# Altium schematic sheet obc-v2_EXP-CAN-RS422.SchDoc
size 420 x 297 mm; SheetNumber: 14; SheetTotal: 23
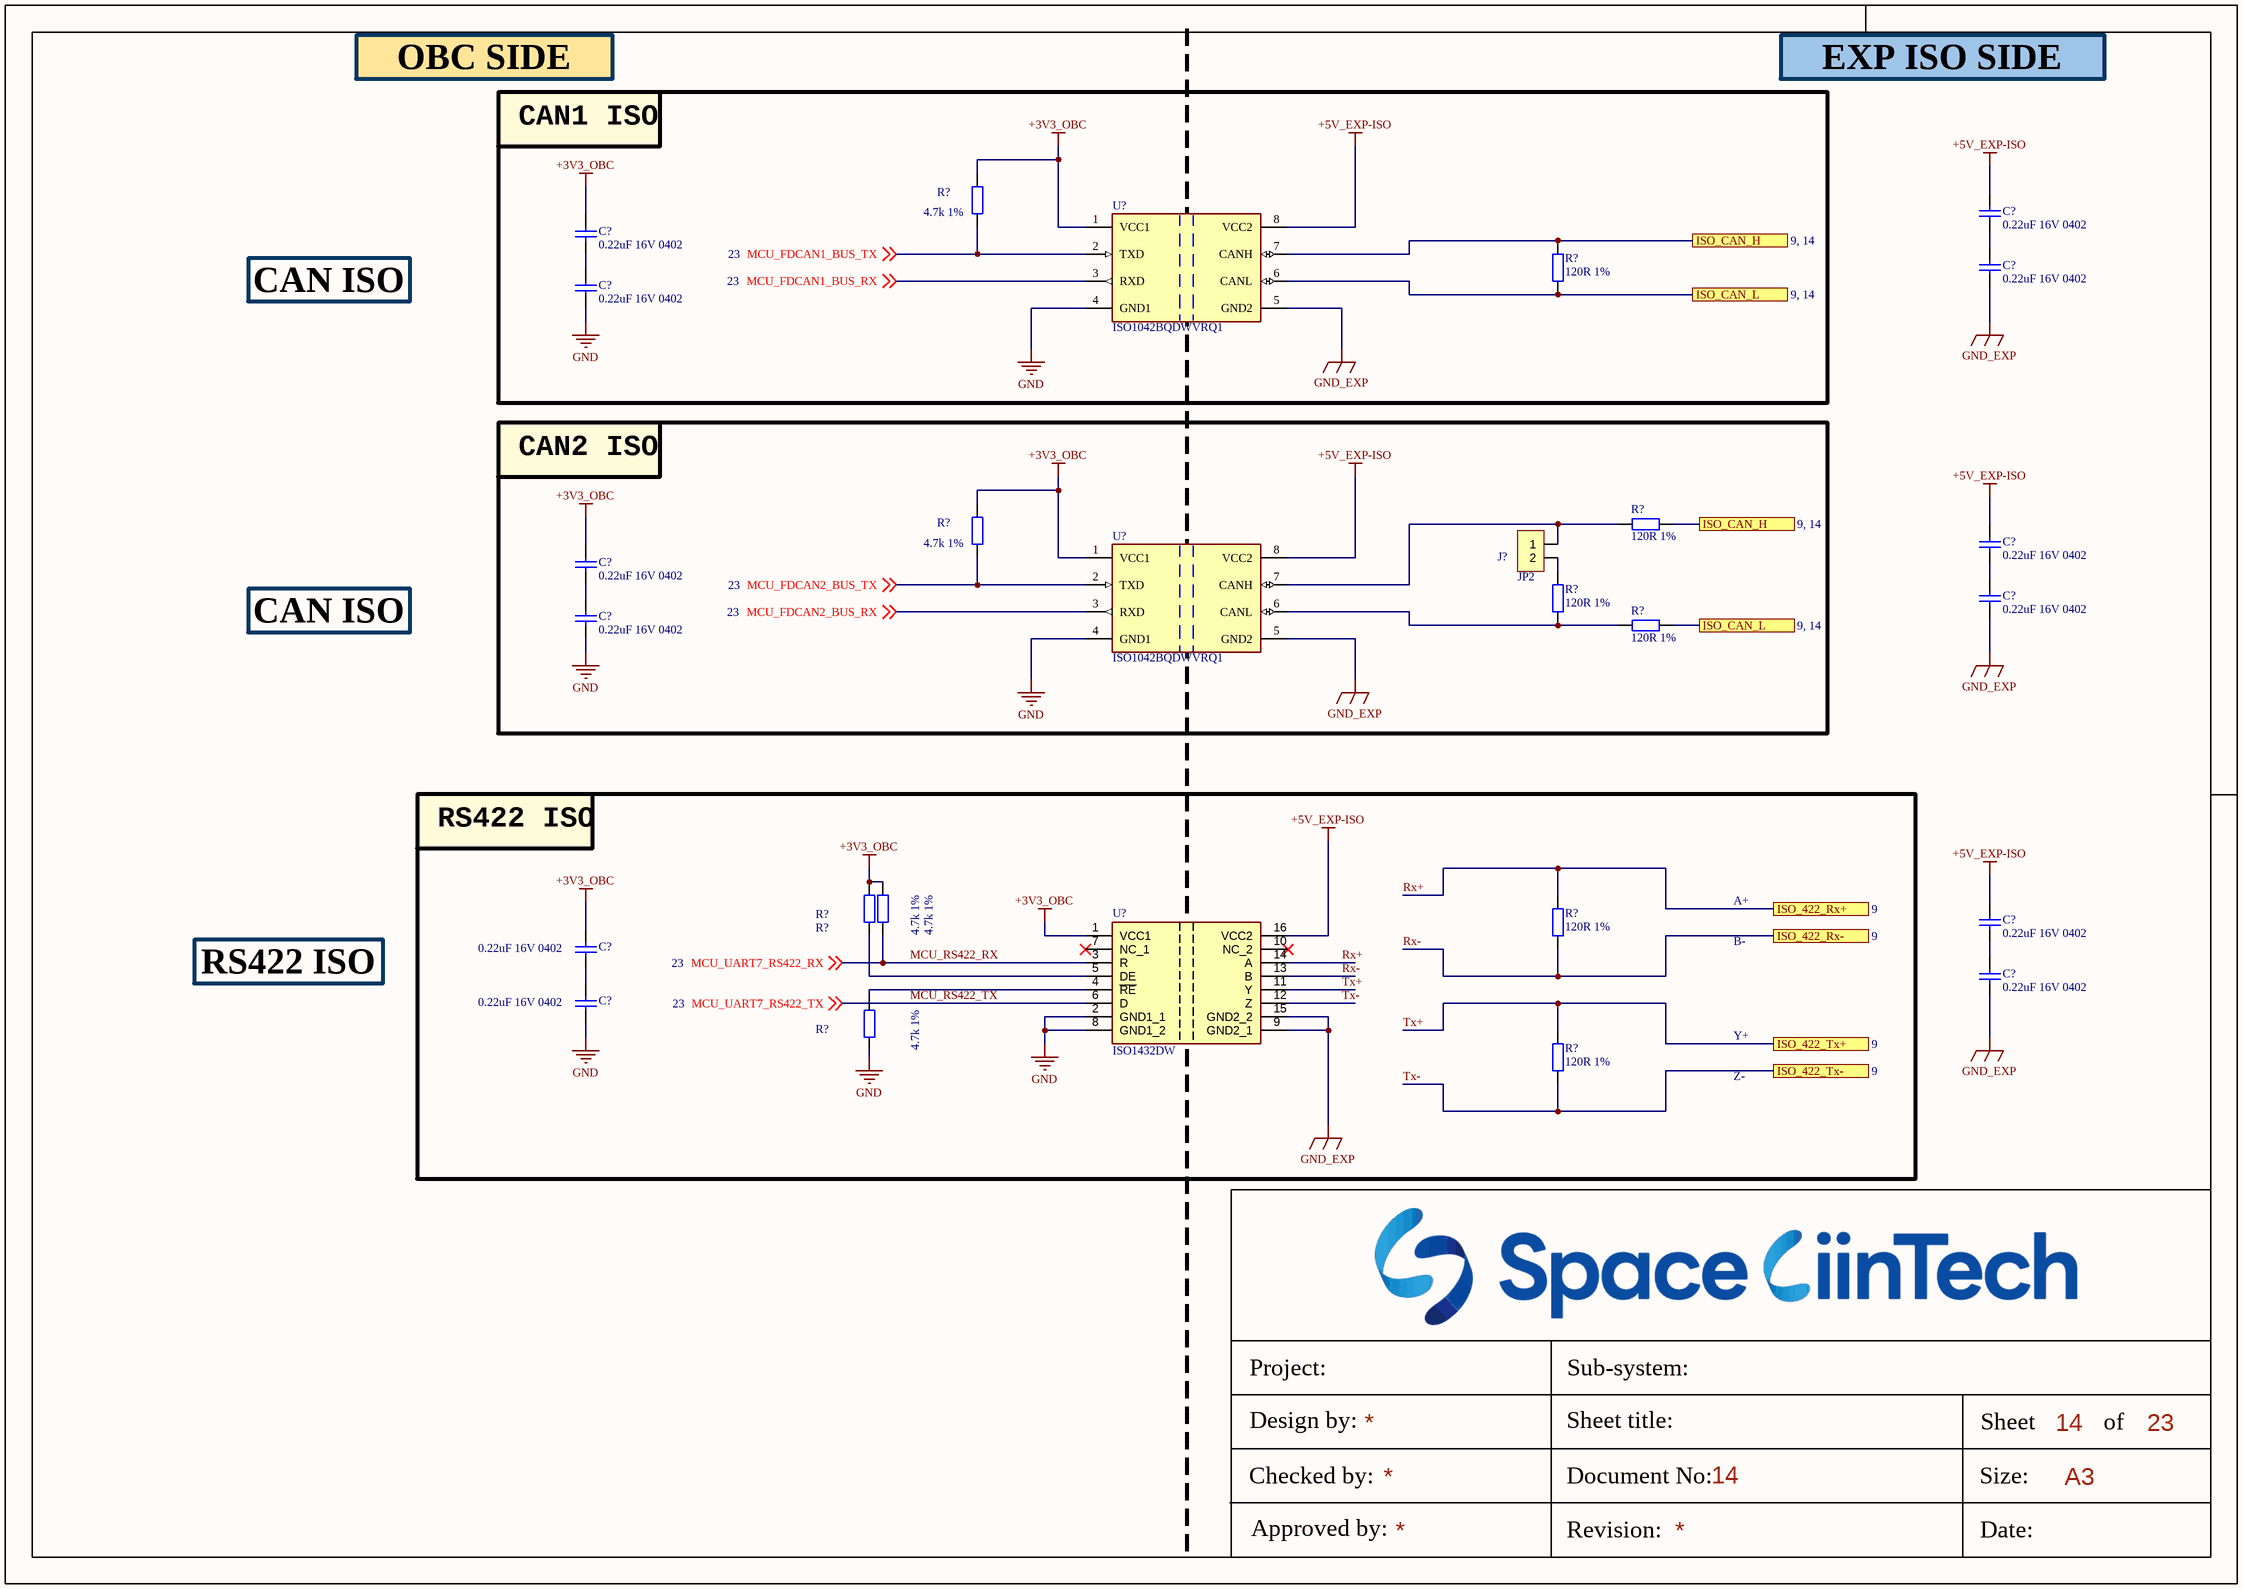
[diagram p0: obc-v2_EXP-CAN-RS422.SchDoc]

## Parts
(Parts that share a designator on the sheet are numbered #1, #2 ... from top to bottom, then left to right.)
C?#1  0.22uF 16V 0402  [tu 0402]
C?#2  0.22uF 16V 0402  [tu 0402]
C?#3  0.22uF 16V 0402  [tu 0402]
C?#4  0.22uF 16V 0402  [tu 0402]
C?#5  0.22uF 16V 0402  [tu 0402]
C?#6  0.22uF 16V 0402  [tu 0402]
C?#7  0.22uF 16V 0402  [tu 0402]
C?#8  0.22uF 16V 0402  [tu 0402]
C?#9  0.22uF 16V 0402  [tu 0402]
C?#10  0.22uF 16V 0402  [tu 0402]
C?#11  0.22uF 16V 0402  [tu 0402]
C?#12  0.22uF 16V 0402  [tu 0402]
J?  JP2  [JP2-D1T]
R?#1  4.7k 1%  [tro smd 0603]
R?#2  120R 1%  [tro smd 0603]
R?#3  120R 1%  [tro smd 0603]
R?#4  4.7k 1%  [tro smd 0603]
R?#5  120R 1%  [tro smd 0603]
R?#6  120R 1%  [tro smd 0603]
R?#7  4.7k 1%  [tro smd 0603]
R?#8  4.7k 1%  [tro smd 0603]
R?#9  120R 1%  [tro smd 0603]
R?#10  4.7k 1%  [tro smd 0603]
R?#11  120R 1%  [tro smd 0603]
U?#1  ISO1042BQDWVRQ1  [FP-DWV0008A-IPC_B]
U?#2  ISO1042BQDWVRQ1  [FP-DWV0008A-IPC_B]
U?#3  ISO1432DW  [SOIC127P1030X265-16N]

## Blocks framed on the sheet
CAN1 ISO: C?#2 C?#4 R?#1 R?#2 U?#1
CAN2 ISO: C?#6 C?#8 J? R?#3-R?#6 U?#2
RS422 ISO: C?#10 C?#12 R?#7-R?#11 U?#3

## Ports
ISO_422_Rx+ (see 9), ISO_422_Rx- (see 9), ISO_422_Tx+ (see 9), ISO_422_Tx- (see 9), ISO_CAN_H (see 9, 14), ISO_CAN_L (see 9, 14)

## Nets
+3V3_OBC: C?#2.1 C?#6.1 C?#10.1 R?#1.2 R?#4.2 R?#7.2 R?#8.2 U?#1.1(VCC1) U?#2.1(VCC1) U?#3.1(VCC1)
+5V_EXP-ISO: C?#1.1 C?#5.1 C?#9.2 U?#1.8(VCC2) U?#2.8(VCC2) U?#3.16(VCC2)
GND: C?#4.2 C?#8.2 C?#12.2 R?#10.1 U?#1.4(GND1) U?#2.4(GND1) U?#3.2(GND1_1) U?#3.8(GND1_2)
GND_EXP: C?#3.2 C?#7.2 C?#11.1 U?#1.5(GND2) U?#2.5(GND2) U?#3.9(GND2_1) U?#3.15(GND2_2)
ISO_CAN_H: R?#2.2 R?#3.1 U?#1.7(CANH) ; port ISO_CAN_H
ISO_CAN_L: R?#2.1 R?#6.1 U?#1.6(CANL) ; port ISO_CAN_L
MCU_FDCAN1_BUS_RX: U?#1.3(RXD) ; off-sheet MCU_FDCAN1_BUS_RX
MCU_FDCAN1_BUS_TX: R?#1.1 U?#1.2(TXD) ; off-sheet MCU_FDCAN1_BUS_TX
MCU_FDCAN2_BUS_RX: U?#2.3(RXD) ; off-sheet MCU_FDCAN2_BUS_RX
MCU_FDCAN2_BUS_TX: R?#4.1 U?#2.2(TXD) ; off-sheet MCU_FDCAN2_BUS_TX
MCU_RS422_RX: R?#8.1 U?#3.3(R) ; off-sheet MCU_UART7_RS422_RX  [also labelled MCU_UART7_RS422_RX]
MCU_RS422_TX: U?#3.6(D) ; off-sheet MCU_UART7_RS422_TX  [also labelled MCU_UART7_RS422_TX]
Rx+: R?#9.2 U?#3.14(A) ; port ISO_422_Rx+
Rx-: R?#9.1 U?#3.13(B) ; port ISO_422_Rx-
Tx+: R?#11.2 U?#3.11(Y) ; port ISO_422_Tx+
Tx-: R?#11.1 U?#3.12(Z) ; port ISO_422_Tx-
NetC?#1_2: C?#1.2 C?#3.1
NetC?#2_2: C?#2.2 C?#4.1
NetC?#5_2: C?#5.2 C?#7.1
NetC?#6_2: C?#6.2 C?#8.1
NetC?#9_1: C?#9.1 C?#11.2
NetC?#10_2: C?#10.2 C?#12.1
NetJ?_1: J?.1 R?#3.2 U?#2.7(CANH)
NetJ?_2: J?.2 R?#5.2
NetR?#5_1: R?#5.1 R?#6.2 U?#2.6(CANL)
NetR?#7_1: R?#7.1 U?#3.5(DE)
NetR?#10_2: R?#10.2 U?#3.4(~{RE})

Not connected (* = marked no-connect by the designer): U?#3 7(NC_1)* 10(NC_2)*

## Notes on the sheet
- OBC SIDE
- EXP ISO SIDE
- CAN ISO
- A+
- RS422 ISO
- B-
- Y+
- Z-
- Project:
- Sub-system:
- Design by:
- Sheet title:
- Sheet
- A3
- of
- Checked by:
- Approved by:
- Revision:
- Document No:
- Size:
- Date:

## Library data of the parts
C?#1-C?#12 = Tu 0402 33nF 10V: 0.22 µF ±10% 16V Ceramic Capacitor X7R 0402 (1005 Metric): GCM155R71C224KE02D; Chung_Loai: Dán; Don_Vi: Con; So_Chan: 2; Ten_Linh_Kien: Tụ 0402 33nF X7R 10V GRM155R71A333KA01D; Ma_Hang: MH007853; Kieu_Chan: *
J? = JP2: WR-PHD 2.54 mm Angled Socket Header; Manufacturer: W¨¹rth Elektronik eiSos GmbH; partNo: 613002143121; ComponentLink1 Description: Manufacturer; ComponentLink2 Description: Datasheet; NoPins: 02; Created Date: 29 March 2013; ComponentLink1URL: http://www.we-online.com; ComponentLink2URL: http://katalog.we-online.de/em/datasheet/6130xx143121.pdf; Created by: Karrer Zheng
R?#1 R?#4 R?#7 R?#8 R?#10 = Tro 0603 1% 10k: RES 4.7K OHM 1% 1/10W 0603, P/N: ERJ-U03F4701V; Chung_Loai: Dán; Don_Vi: Con; So_Chan: 2; Ten_Linh_Kien: Trở 0603 1% 10k; Ma_Hang: MH006333; Kieu_Chan: *
R?#2 R?#3 R?#5 R?#6 R?#9 R?#11 = Tro 0603 1% 10k: RES SMD 120 OHM 1% 1/4W 0603, P/N: RCS0603120RFKEA; Chung_Loai: Dán; Don_Vi: Con; So_Chan: 2; Ten_Linh_Kien: Trở 0603 1% 10k; Ma_Hang: MH006333; Kieu_Chan: *
U?#1 U?#2 = CMP-04872-000086-1: TRANSCEIVER; RoHS Compliant: Yes
U?#3 = ISO1432DWR: RS-422/RS-485 Interface IC 5-kVrms isolated RS-485/RS-422 transceiver with robust EMC 16-SOIC -40 to 125; Manufacturer_Name: Texas Instruments; Manufacturer_Part_Number: ISO1430DW; Geometry.Height: 2.65mm; Mouser Part Number: 595-ISO1430DW; Mouser Price/Stock: https://www.mouser.co.uk/ProductDetail/Texas-Instruments/ISO1430DW?qs=EBDBlbfErPzpJh5zkcdiFg%3D%3D; Arrow Part Number: ISO1430DW; Arrow Price/Stock: https://www.arrow.com/en/products/iso1430dw/texas-instruments?region=nac; Datasheet Link: https://datasheet.datasheetarchive.com/originals/distributors/Datasheets_SAMA/30467ff99f72399b87c3bb1b8b60cbd8.pdf